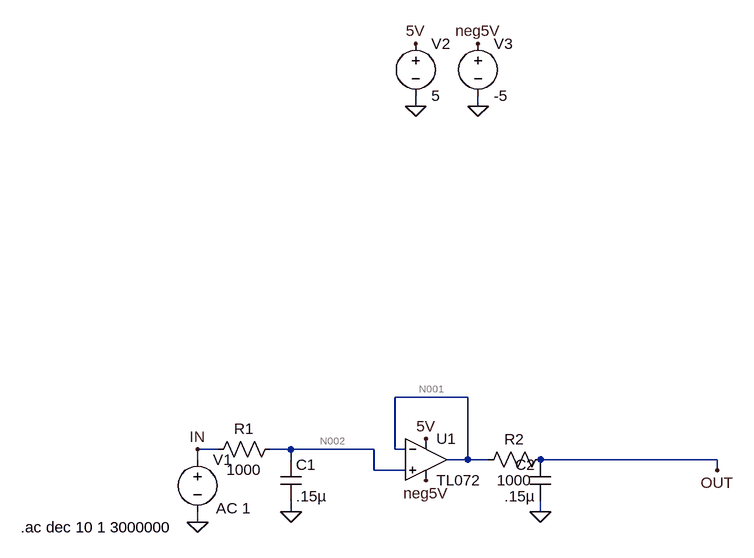
[diagram p0: schematic dual filter.asc]
* dual filter.asc
R1 N002 IN 1000
C1 N002 0 .15µ
V1 IN 0 AC 1
* U1: TL072 (symbol ZZZ\OpAmp\TL072 not available, pins judged from their places): In+=N002 In-=N001 V+=5V V-=neg5V OUT=N001
V2 5V 0 5
V3 neg5V 0 -5
R2 OUT N001 1000
C2 0 OUT .15µ
.ac dec 10 1 3000000
.backanno
.end

* Results of the author's LTspice run, read from the files saved beside the schematic
* Operating Point, zero values left out:
*   V(n002) = -35.05 nV
*   V(n001) = 10.94 µV
*   V(neg5v) = -5 V
*   V(5v) = 5 V
*   V(out) = 10.94 µV
*   I(R1) = -35.05 pA
*   I(V3) = 4.862 mA
*   I(V2) = -4.861 mA
*   I(V1) = -35.05 pA
*   Ix(u1:1) = 35.05 pA
*   Ix(u1:2) = 35.05 pA
*   Ix(u1:3) = 4.861 mA
*   Ix(u1:4) = -4.862 mA
*   Ix(u1:5) = -35.05 pA
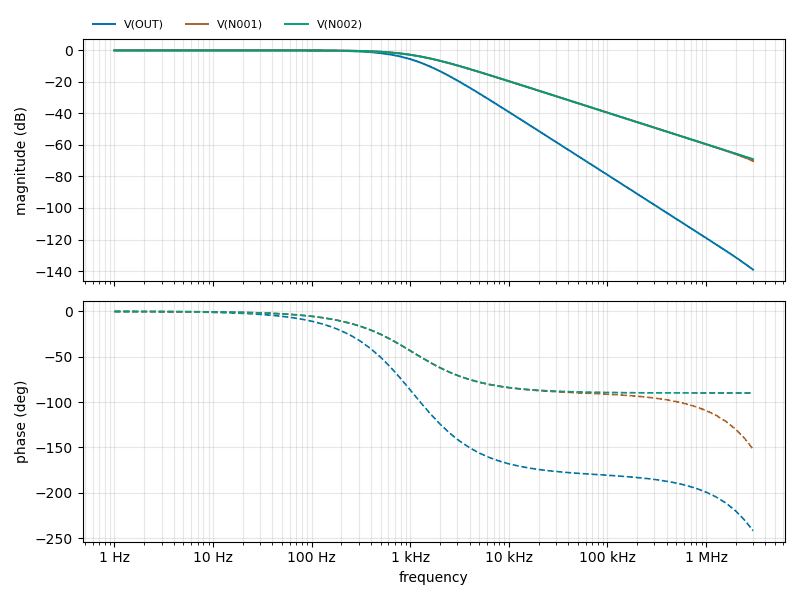
[diagram p1: AC Analysis of dual filter.asc, plotted from the saved traces]
* AC Analysis, 1 run:
*   V(OUT): -0.00 dB at 1 Hz, -139.15 dB at 3 MHz, peak -0.00 dB at 1 Hz, 3 dB below the peak at 677.3 Hz
*   V(N001): -0.00 dB at 1 Hz, -70.12 dB at 3 MHz, peak -0.00 dB at 1 Hz, 3 dB below the peak at 1.056 kHz
*   V(N002): -0.00 dB at 1 Hz, -69.03 dB at 3 MHz, peak -0.00 dB at 1 Hz, 3 dB below the peak at 1.056 kHz